# Altium project MagPogo.PrjPcb
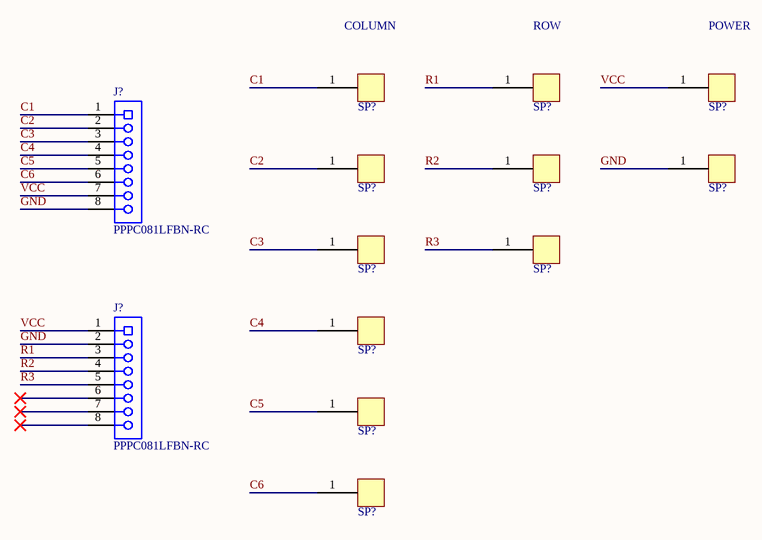
[diagram p0: Master.SchDoc]
1 sheet, 13 parts. Net scope: global (net labels, ports and power ports of the same name join across sheets).

## Sheet Master.SchDoc
size A; SheetNumber: 1; SheetTotal: 1

### Parts
(Parts that share a designator on the sheet are numbered #1, #2 ... from top to bottom, then left to right.)
J?#1  PPPC081LFBN-RC  [SLIN-PPPC081LFBN-RC_V]
J?#2  PPPC081LFBN-RC  [SLIN-PPPC081LFBN-RC_V]
SP?#1  0900-2-15-20-75-14-11-0  [0900-2-15-20-75-14-11-0-Footprint-1]  (value not drawn)
SP?#2  0900-2-15-20-75-14-11-0  [0900-2-15-20-75-14-11-0-Footprint-1]  (value not drawn)
SP?#3  0900-2-15-20-75-14-11-0  [0900-2-15-20-75-14-11-0-Footprint-1]  (value not drawn)
SP?#4  0900-2-15-20-75-14-11-0  [0900-2-15-20-75-14-11-0-Footprint-1]  (value not drawn)
SP?#5  0900-2-15-20-75-14-11-0  [0900-2-15-20-75-14-11-0-Footprint-1]  (value not drawn)
SP?#6  0900-2-15-20-75-14-11-0  [0900-2-15-20-75-14-11-0-Footprint-1]  (value not drawn)
SP?#7  0900-2-15-20-75-14-11-0  [0900-2-15-20-75-14-11-0-Footprint-1]  (value not drawn)
SP?#8  0900-2-15-20-75-14-11-0  [0900-2-15-20-75-14-11-0-Footprint-1]  (value not drawn)
SP?#9  0900-2-15-20-75-14-11-0  [0900-2-15-20-75-14-11-0-Footprint-1]  (value not drawn)
SP?#10  0900-2-15-20-75-14-11-0  [0900-2-15-20-75-14-11-0-Footprint-1]  (value not drawn)
SP?#11  0900-2-15-20-75-14-11-0  [0900-2-15-20-75-14-11-0-Footprint-1]  (value not drawn)

### Nets
C1: J?#1.1
C2: J?#1.2
C3: J?#1.3
C4: J?#1.4
C5: J?#1.5
C6: J?#1.6
GND: J?#1.8 J?#2.2
R1: J?#2.3
R2: J?#2.4
R3: J?#2.5
VCC: J?#1.7 J?#2.1

Not connected (* = marked no-connect by the designer): J?#2 6* 7* 8*; SP?#1 1; SP?#2 1; SP?#3 1; SP?#4 1; SP?#5 1; SP?#6 1; SP?#7 1; SP?#8 1; SP?#9 1; SP?#10 1; SP?#11 1

### Notes on the sheet
- COLUMN
- ROW
- POWER

### Library data of the parts
J?#1 J?#2 = CMP-002-00028-2: Female Header, Pitch 2.54 mm, 1 x 8 Position, Height 8.5 mm, Tail Length 3.2 mm, -40 to 105 degC, RoHS, Bulk; Manufacturer: Sullins; Package Reference: PPPC081LFBN-RC; Connector Type: Header; Datasheet Version: Jan-15; Package Description: Female Header, Pitch 2.54 mm, 1 x 8 Position, Height 8.5 mm, Tail Length 3.2 mm; RoHS Compliant: Unknown; Max Operating Temperature: 105°C; Case/Package: PPPC081LFBN-RC; Min Operating Temperature: -40°C; Datasheet URL: http://sullinscorp.com/catalogs/101_PAGE114-115_.100_FEMALE_HDR.pdf; Gender: Female; Mounting Technology: TH
SP?#1-SP?#11 = CMP-002-00075-1: PCB Terminal; RoHS Compliant: Yes